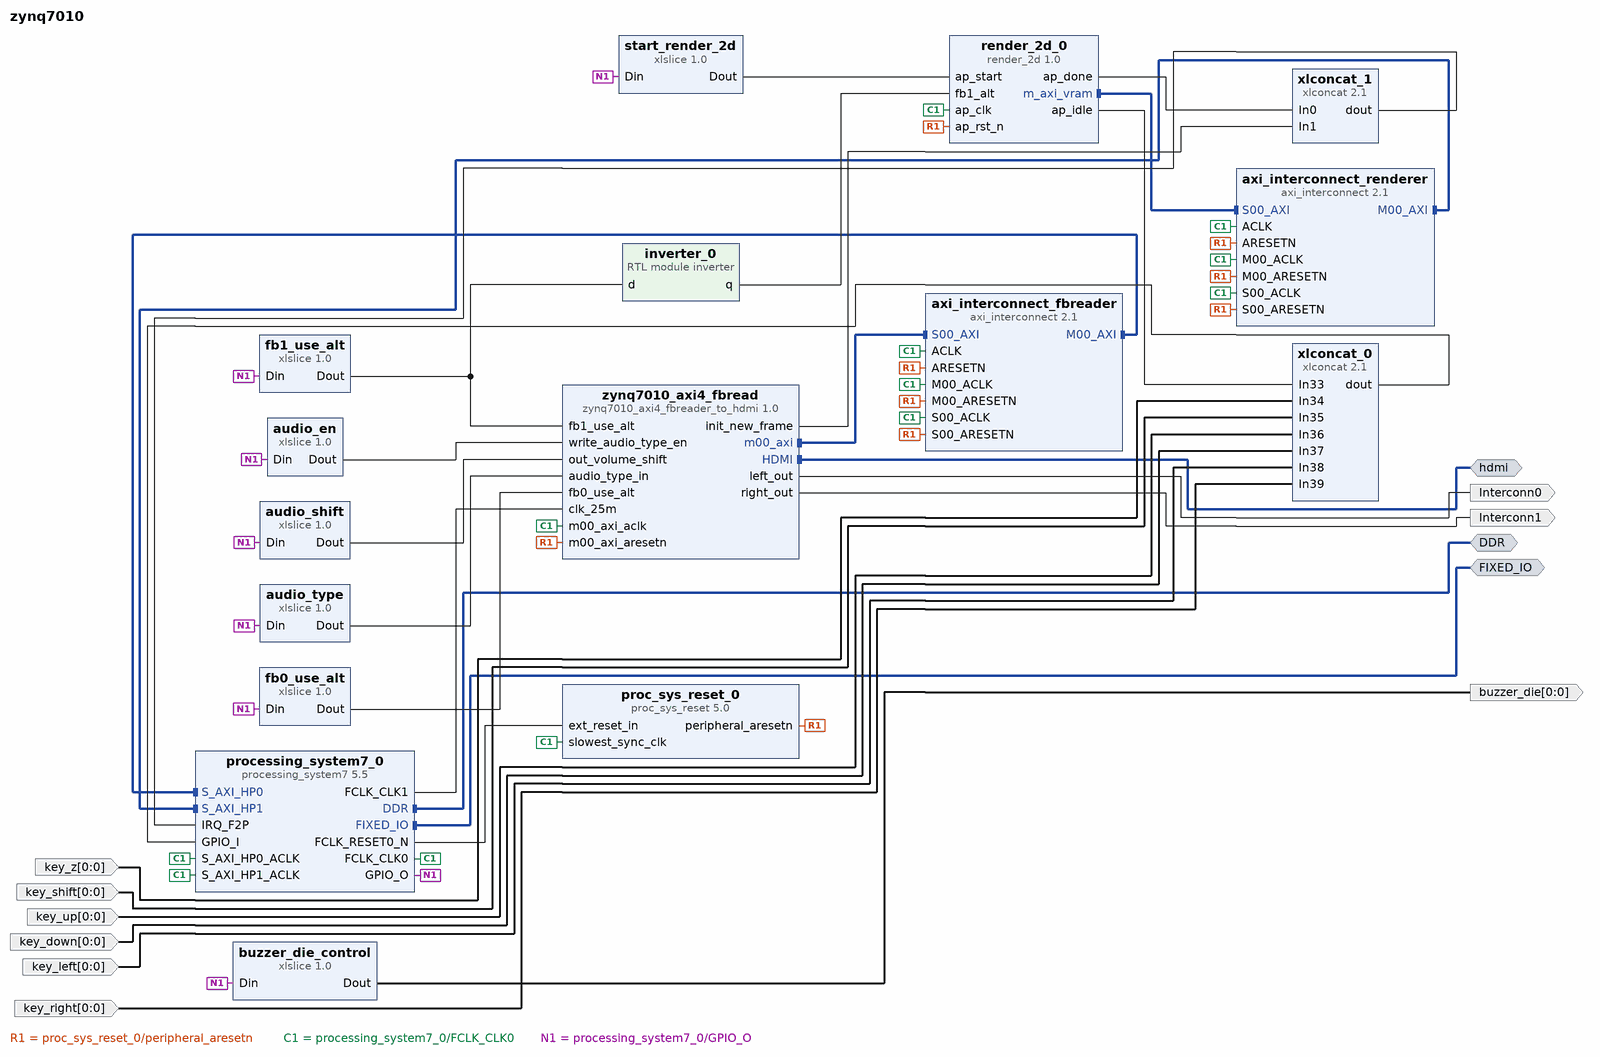
[diagram p0: block diagram of the top level]
# Vivado block design zynq7010, xc7z010clg400-1, Vivado 2022.2
create_bd_design zynq7010

create_bd_intf_port -mode Master -vlnv xilinx.com:interface:ddrx_rtl:1.0 DDR
create_bd_intf_port -mode Master -vlnv xilinx.com:display_processing_system7:fixedio_rtl:1.0 FIXED_IO
create_bd_intf_port -mode Master -vlnv xilinx.com:interface:hdmi_rtl:2.0 hdmi
create_bd_port -dir O Interconn0
create_bd_port -dir O Interconn1
create_bd_port -dir I -from 0 -to 0 key_z
create_bd_port -dir I -from 0 -to 0 key_shift
create_bd_port -dir I -from 0 -to 0 key_up
create_bd_port -dir I -from 0 -to 0 key_down
create_bd_port -dir I -from 0 -to 0 key_left
create_bd_port -dir I -from 0 -to 0 key_right
create_bd_port -dir O -from 0 -to 0 buzzer_die

create_bd_cell -type ip -vlnv xilinx.com:ip:processing_system7:5.5 processing_system7_0
set_property -dict [list \
  CONFIG.PCW_CAN0_CAN0_IO {MIO 14 .. 15} \
  CONFIG.PCW_CAN0_PERIPHERAL_ENABLE 1 \
  CONFIG.PCW_ENET0_ENET0_IO {MIO 16 .. 27} \
  CONFIG.PCW_ENET0_GRP_MDIO_ENABLE 0 \
  CONFIG.PCW_ENET0_PERIPHERAL_ENABLE 1 \
  CONFIG.PCW_ENET0_RESET_ENABLE 0 \
  CONFIG.PCW_ENET_RESET_ENABLE 1 \
  CONFIG.PCW_ENET_RESET_SELECT {Share reset pin} \
  CONFIG.PCW_EN_CLK1_PORT 1 \
  CONFIG.PCW_FCLK_CLK1_BUF TRUE \
  CONFIG.PCW_FPGA0_PERIPHERAL_FREQMHZ 100 \
  CONFIG.PCW_FPGA1_PERIPHERAL_FREQMHZ 25 \
  CONFIG.PCW_FPGA2_PERIPHERAL_FREQMHZ 200 \
  CONFIG.PCW_FPGA_FCLK1_ENABLE 1 \
  CONFIG.PCW_GPIO_EMIO_GPIO_ENABLE 1 \
  CONFIG.PCW_GPIO_EMIO_GPIO_IO 64 \
  CONFIG.PCW_GPIO_MIO_GPIO_ENABLE 1 \
  CONFIG.PCW_GPIO_MIO_GPIO_IO MIO \
  CONFIG.PCW_I2C_RESET_ENABLE 1 \
  CONFIG.PCW_IRQ_F2P_INTR 1 \
  CONFIG.PCW_QSPI_GRP_SINGLE_SS_ENABLE 1 \
  CONFIG.PCW_QSPI_GRP_SINGLE_SS_IO {MIO 1 .. 6} \
  CONFIG.PCW_QSPI_PERIPHERAL_ENABLE 1 \
  CONFIG.PCW_QSPI_QSPI_IO {MIO 1 .. 6} \
  CONFIG.PCW_SD0_GRP_CD_ENABLE 0 \
  CONFIG.PCW_SD0_GRP_WP_ENABLE 0 \
  CONFIG.PCW_SD0_PERIPHERAL_ENABLE 1 \
  CONFIG.PCW_SD0_SD0_IO {MIO 40 .. 45} \
  CONFIG.PCW_SDIO_PERIPHERAL_FREQMHZ 100 \
  CONFIG.PCW_SINGLE_QSPI_DATA_MODE x4 \
  CONFIG.PCW_SPI1_PERIPHERAL_ENABLE 1 \
  CONFIG.PCW_SPI1_SPI1_IO {MIO 10 .. 15} \
  CONFIG.PCW_UART1_PERIPHERAL_ENABLE 1 \
  CONFIG.PCW_UART1_UART1_IO {MIO 8 .. 9} \
  CONFIG.PCW_UART_PERIPHERAL_FREQMHZ 100 \
  CONFIG.PCW_UIPARAM_DDR_FREQ_MHZ 533.33333 \
  CONFIG.PCW_UIPARAM_DDR_MEMORY_TYPE {DDR 3 (Low Voltage)} \
  CONFIG.PCW_UIPARAM_DDR_PARTNO {MT41K256M16 RE-125} \
  CONFIG.PCW_USB0_PERIPHERAL_ENABLE 1 \
  CONFIG.PCW_USB0_RESET_ENABLE 0 \
  CONFIG.PCW_USB0_USB0_IO {MIO 28 .. 39} \
  CONFIG.PCW_USB_RESET_ENABLE 1 \
  CONFIG.PCW_USB_RESET_SELECT {Share reset pin} \
  CONFIG.PCW_USE_FABRIC_INTERRUPT 1 \
  CONFIG.PCW_USE_M_AXI_GP0 0 \
  CONFIG.PCW_USE_S_AXI_HP0 1 \
  CONFIG.PCW_USE_S_AXI_HP1 1 \
] [get_bd_cells processing_system7_0]
# 250 more settings of processing_system7_0 are not shown: defaults, MIO pin electricals, DDR timing, and values the tool derives
create_bd_cell -type ip -vlnv xilinx.com:ip:proc_sys_reset:5.0 proc_sys_reset_0
create_bd_cell -type ip -vlnv xilinx.com:ip:axi_interconnect:2.1 axi_interconnect_fbreader
set_property -dict [list \
  CONFIG.ENABLE_ADVANCED_OPTIONS 1 \
  CONFIG.NUM_MI 1 \
  CONFIG.XBAR_DATA_WIDTH 64 \
] [get_bd_cells axi_interconnect_fbreader]
create_bd_cell -type ip -vlnv xilinx.com:ip:xlslice:1.0 audio_shift
set_property -dict {CONFIG.DIN_FROM 2 CONFIG.DIN_TO 0 CONFIG.DIN_WIDTH 64 CONFIG.DOUT_WIDTH 3} [get_bd_cells audio_shift]
create_bd_cell -type ip -vlnv xilinx.com:ip:xlslice:1.0 audio_en
set_property -dict {CONFIG.DIN_FROM 3 CONFIG.DIN_TO 3 CONFIG.DIN_WIDTH 64 CONFIG.DOUT_WIDTH 1} [get_bd_cells audio_en]
create_bd_cell -type ip -vlnv xilinx.com:ip:xlslice:1.0 audio_type
set_property -dict {CONFIG.DIN_FROM 8 CONFIG.DIN_TO 4 CONFIG.DIN_WIDTH 64 CONFIG.DOUT_WIDTH 5} [get_bd_cells audio_type]
create_bd_cell -type ip -vlnv xilinx.com:ip:xlslice:1.0 fb0_use_alt
set_property -dict {CONFIG.DIN_FROM 9 CONFIG.DIN_TO 9 CONFIG.DIN_WIDTH 64 CONFIG.DOUT_WIDTH 1} [get_bd_cells fb0_use_alt]
create_bd_cell -type ip -vlnv xilinx.com:ip:axi_interconnect:2.1 axi_interconnect_renderer
set_property -dict [list \
  CONFIG.ENABLE_ADVANCED_OPTIONS 1 \
  CONFIG.NUM_MI 1 \
  CONFIG.XBAR_DATA_WIDTH 64 \
] [get_bd_cells axi_interconnect_renderer]
create_bd_cell -type ip -vlnv xilinx.com:ip:xlslice:1.0 fb1_use_alt
set_property -dict {CONFIG.DIN_FROM 10 CONFIG.DIN_TO 10 CONFIG.DIN_WIDTH 64 CONFIG.DOUT_WIDTH 1} [get_bd_cells fb1_use_alt]
create_bd_cell -type ip -vlnv xilinx.com:ip:xlslice:1.0 start_render_2d
set_property -dict {CONFIG.DIN_FROM 11 CONFIG.DIN_TO 11 CONFIG.DIN_WIDTH 64 CONFIG.DOUT_WIDTH 1} [get_bd_cells start_render_2d]
create_bd_cell -type ip -vlnv xilinx.com:ip:xlconcat:2.1 xlconcat_0
set_property -dict {CONFIG.NUM_PORTS 64} [get_bd_cells xlconcat_0]
create_bd_cell -type ip -vlnv xilinx.com:ip:xlconcat:2.1 xlconcat_1
set_property -dict {CONFIG.NUM_PORTS 16} [get_bd_cells xlconcat_1]
create_bd_cell -type ip -vlnv xilinx.com:ip:xlslice:1.0 buzzer_die_control
set_property -dict {CONFIG.DIN_FROM 12 CONFIG.DIN_TO 12 CONFIG.DIN_WIDTH 64 CONFIG.DOUT_WIDTH 1} [get_bd_cells buzzer_die_control]
create_bd_cell -type module -reference inverter inverter_0
create_bd_cell -type ip -vlnv xilinx.com:hls:render_2d:1.0 render_2d_0
create_bd_cell -type ip -vlnv xilinx.com:user:zynq7010_axi4_fbreader_to_hdmi:1.0 zynq7010_axi4_fbread
set_property -dict [list \
  CONFIG.AUDIO_BGM_ADDR 0x014B0000 \
  CONFIG.AUDIO_SFX_ADDR 0x0DE8FB00 \
  CONFIG.FB0_ADDR 0x01000000 \
  CONFIG.FB0_ALT_ADDR 0x01258000 \
  CONFIG.FB1_ADDR 0x0112C000 \
  CONFIG.FB1_ALT_ADDR 0x01384000 \
] [get_bd_cells zynq7010_axi4_fbread]

# ---- connections ----

connect_bd_intf_net -intf_net axi_interconnect_1_M00_AXI [get_bd_intf_pins axi_interconnect_fbreader/M00_AXI] [get_bd_intf_pins processing_system7_0/S_AXI_HP0]
connect_bd_intf_net [get_bd_intf_pins axi_interconnect_renderer/M00_AXI] [get_bd_intf_pins processing_system7_0/S_AXI_HP1]
connect_bd_intf_net [get_bd_intf_ports DDR] [get_bd_intf_pins processing_system7_0/DDR]
connect_bd_intf_net [get_bd_intf_ports FIXED_IO] [get_bd_intf_pins processing_system7_0/FIXED_IO]
connect_bd_intf_net [get_bd_intf_pins render_2d_0/m_axi_vram] [get_bd_intf_pins axi_interconnect_renderer/S00_AXI]
connect_bd_intf_net -intf_net zynq7010_axi4_fbread_0_HDMI [get_bd_intf_ports hdmi] [get_bd_intf_pins zynq7010_axi4_fbread/HDMI]
connect_bd_intf_net [get_bd_intf_pins zynq7010_axi4_fbread/m00_axi] [get_bd_intf_pins axi_interconnect_fbreader/S00_AXI]
connect_bd_net -net In34_0_1 [get_bd_ports key_z] [get_bd_pins xlconcat_0/In34]
connect_bd_net -net In35_0_1 [get_bd_ports key_shift] [get_bd_pins xlconcat_0/In35]
connect_bd_net -net In36_0_1 [get_bd_ports key_up] [get_bd_pins xlconcat_0/In36]
connect_bd_net -net In37_0_1 [get_bd_ports key_down] [get_bd_pins xlconcat_0/In37]
connect_bd_net -net In38_0_1 [get_bd_ports key_left] [get_bd_pins xlconcat_0/In38]
connect_bd_net -net In39_0_1 [get_bd_ports key_right] [get_bd_pins xlconcat_0/In39]
connect_bd_net [get_bd_pins audio_en/Dout] [get_bd_pins zynq7010_axi4_fbread/write_audio_type_en]
connect_bd_net [get_bd_pins audio_shift/Dout] [get_bd_pins zynq7010_axi4_fbread/out_volume_shift]
connect_bd_net [get_bd_pins audio_type/Dout] [get_bd_pins zynq7010_axi4_fbread/audio_type_in]
connect_bd_net [get_bd_pins buzzer_die_control/Dout] [get_bd_ports buzzer_die]
connect_bd_net [get_bd_pins fb1_use_alt/Dout] [get_bd_pins inverter_0/d] [get_bd_pins zynq7010_axi4_fbread/fb1_use_alt]
connect_bd_net -net fb_use_alt_Dout [get_bd_pins fb0_use_alt/Dout] [get_bd_pins zynq7010_axi4_fbread/fb0_use_alt]
connect_bd_net [get_bd_pins inverter_0/q] [get_bd_pins render_2d_0/fb1_alt]
connect_bd_net [get_bd_pins proc_sys_reset_0/peripheral_aresetn] \
  [get_bd_pins axi_interconnect_fbreader/S00_ARESETN] [get_bd_pins axi_interconnect_fbreader/M00_ARESETN] \
  [get_bd_pins axi_interconnect_fbreader/ARESETN] [get_bd_pins axi_interconnect_renderer/ARESETN] \
  [get_bd_pins axi_interconnect_renderer/S00_ARESETN] [get_bd_pins axi_interconnect_renderer/M00_ARESETN] \
  [get_bd_pins render_2d_0/ap_rst_n] [get_bd_pins zynq7010_axi4_fbread/m00_axi_aresetn]
connect_bd_net [get_bd_pins processing_system7_0/FCLK_CLK0] \
  [get_bd_pins proc_sys_reset_0/slowest_sync_clk] [get_bd_pins processing_system7_0/S_AXI_HP0_ACLK] \
  [get_bd_pins axi_interconnect_fbreader/S00_ACLK] [get_bd_pins axi_interconnect_fbreader/M00_ACLK] \
  [get_bd_pins axi_interconnect_fbreader/ACLK] [get_bd_pins axi_interconnect_renderer/ACLK] \
  [get_bd_pins axi_interconnect_renderer/S00_ACLK] [get_bd_pins axi_interconnect_renderer/M00_ACLK] \
  [get_bd_pins processing_system7_0/S_AXI_HP1_ACLK] [get_bd_pins render_2d_0/ap_clk] \
  [get_bd_pins zynq7010_axi4_fbread/m00_axi_aclk]
connect_bd_net [get_bd_pins processing_system7_0/FCLK_CLK1] [get_bd_pins zynq7010_axi4_fbread/clk_25m]
connect_bd_net [get_bd_pins processing_system7_0/FCLK_RESET0_N] [get_bd_pins proc_sys_reset_0/ext_reset_in]
connect_bd_net [get_bd_pins processing_system7_0/GPIO_O] \
  [get_bd_pins audio_shift/Din] [get_bd_pins audio_en/Din] [get_bd_pins audio_type/Din] [get_bd_pins fb0_use_alt/Din] \
  [get_bd_pins fb1_use_alt/Din] [get_bd_pins start_render_2d/Din] [get_bd_pins buzzer_die_control/Din]
connect_bd_net [get_bd_pins render_2d_0/ap_done] [get_bd_pins xlconcat_1/In0]
connect_bd_net [get_bd_pins render_2d_0/ap_idle] [get_bd_pins xlconcat_0/In33]
connect_bd_net [get_bd_pins start_render_2d/Dout] [get_bd_pins render_2d_0/ap_start]
connect_bd_net [get_bd_pins xlconcat_0/dout] [get_bd_pins processing_system7_0/GPIO_I]
connect_bd_net [get_bd_pins xlconcat_1/dout] [get_bd_pins processing_system7_0/IRQ_F2P]
connect_bd_net [get_bd_pins zynq7010_axi4_fbread/init_new_frame] [get_bd_pins xlconcat_1/In1]
connect_bd_net [get_bd_pins zynq7010_axi4_fbread/left_out] [get_bd_ports Interconn0]
connect_bd_net [get_bd_pins zynq7010_axi4_fbread/right_out] [get_bd_ports Interconn1]

# ---- address map ----
assign_bd_address -offset 0x00000000 -range 1G -target_address_space [get_bd_addr_spaces render_2d_0/Data_m_axi_vram] [get_bd_addr_segs processing_system7_0/S_AXI_HP1/HP1_DDR_LOWOCM]
assign_bd_address -offset 0x00000000 -range 1G -target_address_space [get_bd_addr_spaces zynq7010_axi4_fbread/m00_axi] [get_bd_addr_segs processing_system7_0/S_AXI_HP0/HP0_DDR_LOWOCM]

validate_bd_design
save_bd_design
